# Altium schematic sheet 05-USB-Prog.SchDoc
size B; SheetNumber: 5; SheetTotal: 8
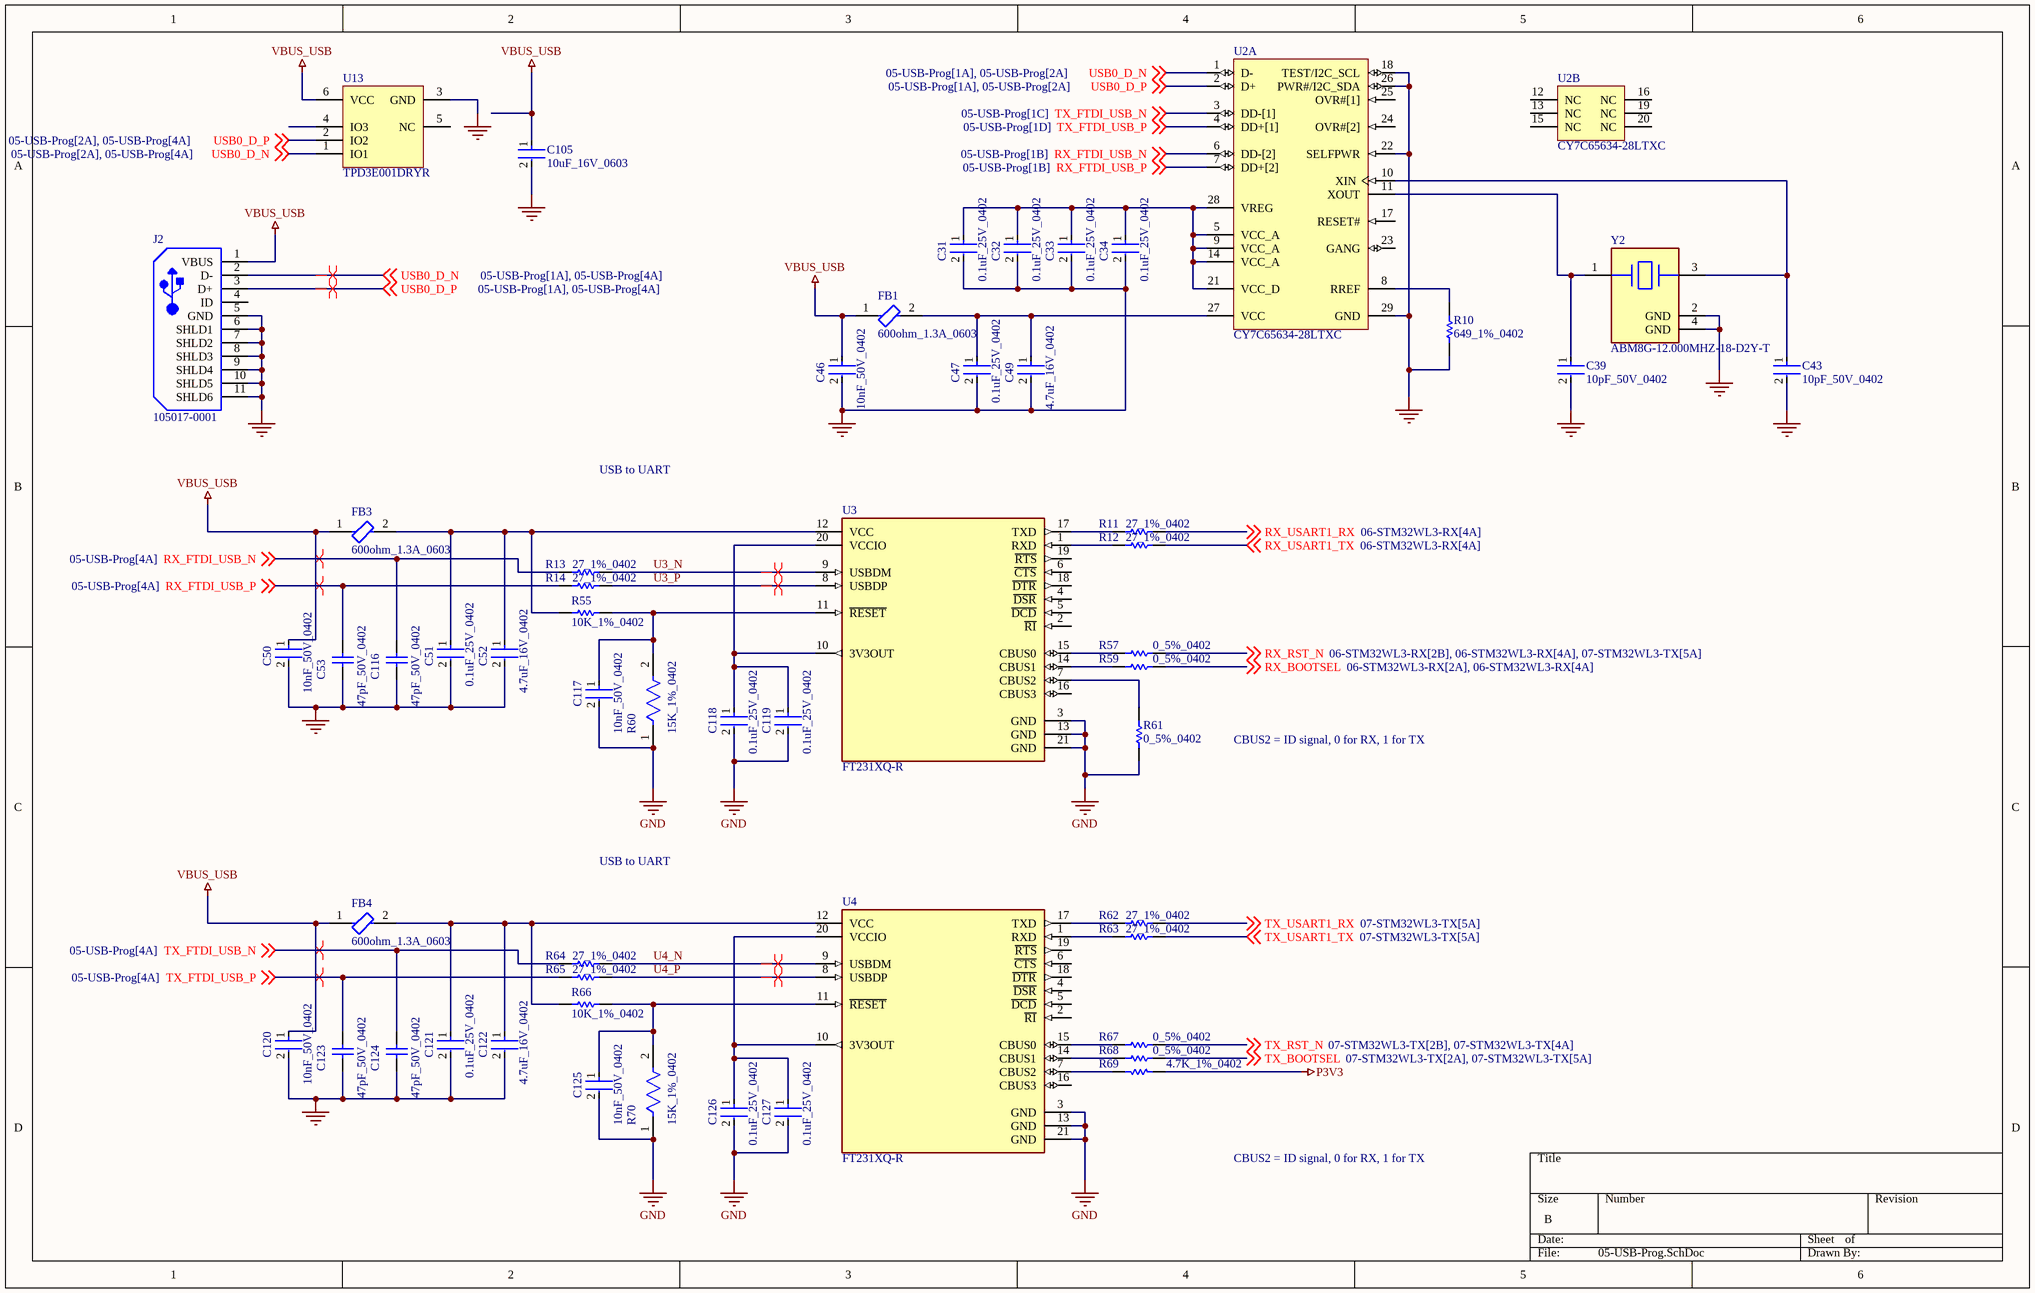
[diagram p0: 05-USB-Prog.SchDoc]

## Parts
C31  0.1uF_25V_0402  [FP-0402-L_1_0_1-W_0_5_0_1-IPC_C]
C32  0.1uF_25V_0402  [FP-0402-L_1_0_1-W_0_5_0_1-IPC_C]
C33  0.1uF_25V_0402  [FP-0402-L_1_0_1-W_0_5_0_1-IPC_C]
C34  0.1uF_25V_0402  [FP-0402-L_1_0_1-W_0_5_0_1-IPC_C]
C39  10pF_50V_0402  [FP-C1005-050-0_05-IPC_C]
C43  10pF_50V_0402  [FP-C1005-050-0_05-IPC_C]
C46  10nF_50V_0402  [FP-CC0402-MFG]
C47  0.1uF_25V_0402  [FP-0402-L_1_0_1-W_0_5_0_1-IPC_C]
C49  4.7uF_16V_0402  [FP-CL829-IPC_C]
C50  10nF_50V_0402  [FP-CC0402-MFG]
C51  0.1uF_25V_0402  [FP-0402-L_1_0_1-W_0_5_0_1-IPC_C]
C52  4.7uF_16V_0402  [FP-CL829-IPC_C]
C53  47pF_50V_0402  [CAPC1005X55X25LL05T10]
C105  10uF_16V_0603  [FP-0603-L_1_6_0_2-W_0_8_0-MFG]
C116  47pF_50V_0402  [CAPC1005X55X25LL05T10]
C117  10nF_50V_0402  [FP-CC0402-MFG]
C118  0.1uF_25V_0402  [FP-0402-L_1_0_1-W_0_5_0_1-IPC_C]
C119  0.1uF_25V_0402  [FP-0402-L_1_0_1-W_0_5_0_1-IPC_C]
C120  10nF_50V_0402  [FP-CC0402-MFG]
C121  0.1uF_25V_0402  [FP-0402-L_1_0_1-W_0_5_0_1-IPC_C]
C122  4.7uF_16V_0402  [FP-CL829-IPC_C]
C123  47pF_50V_0402  [CAPC1005X55X25LL05T10]
C124  47pF_50V_0402  [CAPC1005X55X25LL05T10]
C125  10nF_50V_0402  [FP-CC0402-MFG]
C126  0.1uF_25V_0402  [FP-0402-L_1_0_1-W_0_5_0_1-IPC_C]
C127  0.1uF_25V_0402  [FP-0402-L_1_0_1-W_0_5_0_1-IPC_C]
FB1  600ohm_1.3A_0603  [FP-BLM18-0_15-t0_8-IPC_A]
FB3  600ohm_1.3A_0603  [FP-BLM18-0_15-t0_8-IPC_A]
FB4  600ohm_1.3A_0603  [FP-BLM18-0_15-t0_8-IPC_A]
J2  105017-0001  [USB-MICRO-B_V]
R10  649_1%_0402  [RESC1005X40X25LL05T05]
R11  27_1%_0402  [RESC1005X40X25NL05T05]
R12  27_1%_0402  [RESC1005X40X25NL05T05]
R13  27_1%_0402  [RESC1005X40X25NL05T05]
R14  27_1%_0402  [RESC1005X40X25NL05T05]
R55  10K_1%_0402  [RESC1005X40X25LL05T10]
R57  0_5%_0402  [RESC1005X40X25NL05T10]
R59  0_5%_0402  [RESC1005X40X25NL05T10]
R60  15K_1%_0402  [FP-ERJ2R-MFG]
R61  0_5%_0402  [RESC1005X40X25NL05T10]
R62  27_1%_0402  [RESC1005X40X25NL05T05]
R63  27_1%_0402  [RESC1005X40X25NL05T05]
R64  27_1%_0402  [RESC1005X40X25NL05T05]
R65  27_1%_0402  [RESC1005X40X25NL05T05]
R66  10K_1%_0402  [RESC1005X40X25LL05T10]
R67  0_5%_0402  [RESC1005X40X25NL05T10]
R68  0_5%_0402  [RESC1005X40X25NL05T10]
R69  4.7K_1%_0402  [RESC1005X40X25NL10T10]
R70  15K_1%_0402  [FP-ERJ2R-MFG]
U2  CY7C65634-28LTXC  [CYP-LTX28_M]  (parts A,B of 2)
U3  FT231XQ-R  [FP-QFN-20-MFG]
U4  FT231XQ-R  [FP-QFN-20-MFG]
U13  TPD3E001DRYR  [DRY0006A]
Y2  ABM8G-12.000MHZ-18-D2Y-T  [FP-ABM8G-MFG]

## Nets
GND: C31.2 C32.2 C33.2 C34.2 C39.2 C43.2 C46.2 C47.2 C49.2 C50.2 C51.2 C52.2 C53.1 C105.2 C116.1 C117.2 C118.2 C119.2 C120.2 C121.2 C122.2 C123.1 C124.1 C125.2 C126.2 C127.2 J2.5(GND) J2.6(SHLD1) J2.7(SHLD2) J2.8(SHLD3) J2.9(SHLD4) J2.10(SHLD5) J2.11(SHLD6) R10.1 R60.1 R61.1 R70.1 U2.18(TEST/I2C_SCL) U2.22(SELFPWR) U2.26(PWR#/I2C_SDA) U2.29(GND) U3.3(GND) U3.13(GND) U3.21(GND) U4.3(GND) U4.13(GND) U4.21(GND) U13.3(GND) Y2.2(GND) Y2.4(GND)
P3V3: R69.1
VBUS_USB: C46.1 C50.1 C105.1 C120.1 FB1.1 FB3.1 FB4.1 J2.1(VBUS) U13.6(VCC)
RX_BOOTSEL: R59.2 ; off-sheet RX_BOOTSEL
RX_FTDI_USB_N: C116.2 R13.1 U2.6(DD-[2]) ; off-sheet RX_FTDI_USB_N
RX_FTDI_USB_P: C53.2 R14.1 U2.7(DD+[2]) ; off-sheet RX_FTDI_USB_P
RX_RST_N: R57.2 ; off-sheet RX_RST_N
RX_USART1_RX: R11.2 ; off-sheet RX_USART1_RX
RX_USART1_TX: R12.2 ; off-sheet RX_USART1_TX
TX_BOOTSEL: R68.2 ; off-sheet TX_BOOTSEL
TX_FTDI_USB_N: C124.2 R64.1 U2.3(DD-[1]) ; off-sheet TX_FTDI_USB_N
TX_FTDI_USB_P: C123.2 R65.1 U2.4(DD+[1]) ; off-sheet TX_FTDI_USB_P
TX_RST_N: R67.2 ; off-sheet TX_RST_N
TX_USART1_RX: R62.2 ; off-sheet TX_USART1_RX
TX_USART1_TX: R63.2 ; off-sheet TX_USART1_TX
U3_N: R13.2 U3.9(USBDM)
U3_P: R14.2 U3.8(USBDP)
U4_N: R64.2 U4.9(USBDM)
U4_P: R65.2 U4.8(USBDP)
USB0_D_N: J2.2(D-) U2.1(D-) U13.1(IO1) ; off-sheet USB0_D_N
USB0_D_P: J2.3(D+) U2.2(D+) U13.2(IO2) ; off-sheet USB0_D_P
NetC31_1: C31.1 C32.1 C33.1 C34.1 U2.5(VCC_A) U2.9(VCC_A) U2.14(VCC_A) U2.21(VCC_D) U2.28(VREG)
NetC39_1: C39.1 U2.11(XOUT) Y2.1
NetC43_1: C43.1 U2.10(XIN) Y2.3
NetC47_1: C47.1 C49.1 FB1.2 U2.27(VCC)
NetC51_1: C51.1 C52.1 FB3.2 R55.2 U3.12(VCC)
NetC117_1: C117.1 R55.1 R60.2 U3.11(~{RESET})
NetC118_1: C118.1 C119.1 U3.10(3V3OUT) U3.20(VCCIO)
NetC121_1: C121.1 C122.1 FB4.2 R66.2 U4.12(VCC)
NetC125_1: C125.1 R66.1 R70.2 U4.11(~{RESET})
NetC126_1: C126.1 C127.1 U4.10(3V3OUT) U4.20(VCCIO)
NetR10_2: R10.2 U2.8(RREF)
NetR11_1: R11.1 U3.17(TXD)
NetR12_1: R12.1 U3.1(RXD)
NetR57_1: R57.1 U3.15(CBUS0)
NetR59_1: R59.1 U3.14(CBUS1)
NetR61_2: R61.2 U3.7(CBUS2)
NetR62_1: R62.1 U4.17(TXD)
NetR63_1: R63.1 U4.1(RXD)
NetR67_1: R67.1 U4.15(CBUS0)
NetR68_1: R68.1 U4.14(CBUS1)
NetR69_2: R69.2 U4.7(CBUS2)

Not connected (* = marked no-connect by the designer): J2 4(ID); U2 12(NC) 13(NC) 15(NC) 16(NC) 17(RESET#) 19(NC) 20(NC) 23(GANG) 24(OVR#[2]) 25(OVR#[1]); U3 2(~{RI}) 4(~{DSR}) 5(~{DCD}) 6(~{CTS}) 16(CBUS3) 18(~{DTR}) 19(~{RTS}); U4 2(~{RI}) 4(~{DSR}) 5(~{DCD}) 6(~{CTS}) 16(CBUS3) 18(~{DTR}) 19(~{RTS}); U13 4(IO3) 5(NC)

## Layout directives
differential pair: RX_FTDI_USB_N, RX_FTDI_USB_P, TX_FTDI_USB_N, TX_FTDI_USB_P, U3_N, U3_P, U4_N, U4_P, USB0_D_N, USB0_D_P

## Notes on the sheet
- USB to UART
- CBUS2 = ID signal, 0 for RX, 1 for TX

## Library data of the parts
C31-C34 C47 C51 C118 C119 C121 C126 C127 = CMP-2008-02519-2: General Purpose Ceramic Capacitor, 0402, 100nF, 10%, X7R, 15%, 25V; Package Quantity: 1; Capacitance: 100nF; Min Operating Temperature: -55°C; Voltage: 25V; Voltage Rating: 25V; Construction: Flat; Max Operating Temperature: 125°C; Radiation Hardening: No; Depth: 0.5mm; Thickness: 0.022inch; Voltage Rating (DC): 25V; Number of Pins: 2; Lead Free: Lead Free; Series: -; REACH SVHC: No SVHC; Length: 1mm; Dielectric: X7R; RoHS Compliant: Yes; Mount: Surface Mount; Packaging: Tape and Reel; Case/Package: 0402; Case Code (Imperial): 0402; Termination: SMD/SMT; Width: 0.02inch; Case Code (Metric): 1005; Tolerance: 10%
C39 C43 = CMP-08246-002674-1: CAP CER 10PF 50V C0G 0402; Temperature Coefficient: 30ppm/°C; Dielectric Material: Ceramic; Termination: SMD/SMT; Width: 0.02inch; Case Code (Metric): 1005; Thickness: 0.022inch; Height: 0.5mm; REACH SVHC: No SVHC; Case Code (Imperial): 0402; Voltage: 50V; Capacitance: 10pF; Max Operating Temperature: 125°C; Length: 1mm; Construction: Flat; Packaging: Tape and Reel; Lead Free: Lead Free; Series: C; Depth: 0.5mm; Dielectric: C0G; Package Quantity: 1; Mount: Surface Mount; Voltage Rating (DC): 50V; Voltage Rating: 50V; Case/Package: 0402; RoHS Compliant: Yes; Min Operating Temperature: -55°C; Number of Pins: 2; Radiation Hardening: No; Weight: 2.3E-05oz
C46 C50 C117 C120 C125 = CMP-2100-03592-2: CAP CER 10000PF 50V X7R 0402; Manufacturer Part Number: CC0402KRX7R9BB103; Manufacturer: YAGEO; Temperature Coefficient: 30ppm/°C; Capacitance: 10 nF; Material: Ceramic; Automotive Grade: NA; Tolerance: 0.1; Value: 10 nF; Device Class L3: Ceramic Capacitors; Temperature: -55°C to +125°C; Footprint Url: http://www.yageo.com/exep/pages/download/literatures/UPY-C_GEN_24.pdf; Ipc Land Pattern Name: CAPC10050X50; Device Class L1: Passive Components; Automotive: No; Octopart: https://octopart.com/cc0402krx7r9bb103-yageo-8376513; Lead Free: Yes; Temperature Range Low: -55°C; Height: 0.55mm; ComponentLink2URL: http://www.yageo.com/documents/recent/UPY-GP_NP0_16V-to-50V_16.pdf; Category: Cap; ComponentLink2Description: Datasheet; Temperature Range High: +125°C; Digikey Description: CAP CER 10000PF 50V X7R 0402; Voltage Rating: 50 V; Package: CC0402; Device Class L2: Capacitors; Mouser Description: 0402 10 nF 50 V ±10 % Tolerance X7R SMT Multilayer Ceramic Capacitor; RoHS: TRUE; Temperature Characteristic: X7R
C49 C52 C122 = CMP-13271-001468-1: Cap Ceramic 4.7uF 16V X5R ±20% SMD 0402 +85°C Paper T/R; Mount: Surface Mount; Case Code (Metric): 1005; Case/Package: 0402; Length: 0.039inch; Capacitance: 4.7uF; Voltage Rating: 16V; Max Operating Temperature: 85°C; Tolerance: 20%; Thickness: 0.022inch; Min Operating Temperature: -55°C; Case Code (Imperial): 0402; Packaging: Tape and Reel; Width: 0.02inch
C53 C116 C123 C124 = CMP-2008-04368-1: Part Number: GRM1555C1H470JA01D; Manufacturer: Murata
C105 = CMP-2000-06226-4: Multilayer Ceramic Capacitor 10uF 16V X5R 20% SMD 0603 T/R; Packaging: Tape and Reel; Construction: Flat; Height: 0.8mm; Max Operating Temperature: 85°C; Dielectric: X5R; Case Code (Metric): 1608; Voltage Rating (DC): 16V; Width: 0.031inch; Voltage Rating: 16V; Length: 0.063inch; RoHS Compliant: Yes; Halogen Free: Halogen Free; Case Code (Imperial): 0603; Capacitance: 10uF; Mount: Surface Mount; Thickness: 0.031inch; Tolerance: 20%; Min Operating Temperature: -55°C; Series: M; Termination: SMD/SMT; Case/Package: 0603; Package Quantity: 1
FB1 FB3 FB4 = CMP-0686-00581-3: Chip Ferrite Bead, 0603, 600Ω @ 100MHz, 0.15Ω, 25%, 1.3A; Material: Steel; Number of Lines: 1; Impedance: 600R; DC Resistance (DCR): 150mR; Tolerance: 25%; Case Code (Metric): 1608; Width: 0.8mm; DC Current: 1.3A; Max DC Current: 1.3A; Package Quantity: 1; Number of Pins: 2; Military Standard: Not; RoHS Compliant: Yes; Termination: SMD/SMT; Max Operating Temperature: 125°C; Length: 1.6mm; Depth: 0.8mm; Case Code (Imperial): 0603; Series: BLM18K; Inductor Type: FERRITE BEAD; Core Material: Ferrite; Number of Circuits: 1; Height: 0.8mm; Case/Package: 0603; REACH SVHC: No SVHC; Packaging: Tape and Reel; Min Operating Temperature: -55°C; Max Current Rating: 1.3A; Radiation Hardening: No; Current Rating: 1.3A; Lead Free: Lead Free; Test Frequency: 100MHz; Weight: 7.1E-05oz
J2 = CMP-2000-05827-1: Micro-USB B Receptacle, Right Angle, Bottom Mount, Surface Mount, with Solder Tabs, -30 to 85 degC, 5-Pin USB, RoHS, Tape and Reel; Manufacturer: Molex; Featured Product: Micro-USBConnectorsUSBConnectors; Other Names: WM1399DKR; Package Version: Rev. F, 12/2012; Number of Contacts: 5; Connector Type: USB-microB; Catalog Drawings: 1050170001; 3D Model: 105017-0001.stp; Mating Products: WM17145-ND-CABLEMICROUSBBTOSTDA1.0MWM17147-ND-CABLEMICROUSBBTOSTDA2.0MWM17146-ND-CABLEMICROUSBBTOSTDA1.5M; PCN Assembly/Origin: ResinSupplier21/Oct/2015; Voltage - Max: 30V; Online Catalog: Molex-MicroUSB; Manufacturer URL: http://www.molex.com/; Package Description: 5-Leads USB, Micro B, Body 7.5 x 5 mm, Pitch 0.65 mm; Datasheet URL: http://www.molex.com/elqNow/elqRedir.htm?ref=http://www.molex.com/webdocs/datasheets/pdf/en-us/1050170001_IO_CONNECTORS.pdf; Ingress Protection: -; Datasheet Version: 03/2016; Mounting Type: BoardCutout,SurfaceMount,RightAngle; Circuits: 5; Standard Package: 1; Package Reference: MICRO-B; Package URL: http://www.molex.com/pdm_docs/sd/1050170001_sd.pdf; Category: Connectors,Interconnects; Series: -; RoHS Information: 1050170001CertofCompliance; Features: Shielded,SolderRetention; Family: USB,DVI,HDMIConnectors; Specifications: -; Gender: Receptacle; Packaging: Digi-Reel®; Mounting Technology: SurfaceMount
R10 = CMP-2002-01027-1: Part Number: ERJ-2RKF6490X; Manufacturer: Panasonic
R11-R14 R62-R65 = CMP-2002-08434-1: Part Number: CRCW040227R0FKED; Manufacturer: Vishay Dale
R55 R66 = CMP-2002-07353-1: Part Number: RC0402FR-0710KL; Manufacturer: Yageo / Phycomp
R57 R59 R61 R67 R68 = CMP-2002-06457-1: Manufacturer: Panasonic; Part Number: ERJ-U020R00X
R60 R70 = CMP-2002-00694-4: RES SMD 15K OHM 1% 1/10W 0402; Manufacturer Part Number: ERJ-2RKF1502X; Manufacturer: Panasonic; Automotive Grade: Grade 0; Voltage Rating: 50V; Resistance: 15kΩ; Temperature Coefficient: 100ppm/°C; Power Rating: 0.1W; Value: 15kΩ; ComponentLink2URL: https://industrial.panasonic.com/cdbs/www-data/pdf/RDA0000/AOA0000C304.pdf; Automotive: Yes; Temperature: -55°C to +155°C; Height: 0.4mm; Digikey Description: RES SMD 15K OHM 1% 1/10W 0402; Category: Res; Device Class L2: Resistors; Device Class L1: Passive Components; Package: ERJ2R; Temperature Range Low: -55°C; Tolerance: 1%; Series: ERJ; Footprint Url: https://b2b-api.panasonic.eu/file_stream/pids/fileversion/1180; Mouser Description: Res Thick Film 1.0 x 0.5 mm 15K Ohm 1% 0.1W(1/10W) 100ppm/ C Molded SMD Punched Carrier T/R; Composition: Thick Film; Lead Free: Yes; Device Class L3: Chip SMD Resistors; Octopart: https://octopart.com/erj-2rkf1502x-panasonic-55404985; RoHS: TRUE; Temperature Range High: +155°C; ComponentLink2Description: Datasheet
R69 = CMP-2002-05217-1: Manufacturer: Bourns; Part Number: CR0402-FX-4701GLF
U2 = CMP-0967-00085-1: HX2VL(TM) Very Low Power USB 2.0 Hub Controller, 2 Hub Ports, 0 to 70 degC, 28-Pin QFN (LTX28), Bulk; Manufacturer: Cypress; No. of Hub Ports: 2; Max. Operating Voltage (V): 5.25; Single/Multi TT: Single; Min. Operating Voltage (V): 3.15; PackageVersion: Rev. **, 10/2010; ComponentLink1Description: Manufacturer URL; Max. Operating Temp. (degreesC): 70; ComponentLink2URL: http://www.cypress.com/?docID=39996; Mounting Technology: Surface Mount; ComponentLink3Description: Package Specification; PackageDescription: 28-Pin Quad Flat No-Lead Package, Body 5 x 5 mm, Pitch 0.5 mm; DatasheetVersion: Rev. *F; RoHS: Pb-Free; Min. Operating Temp. (degreesC): 0; ComponentLink2Description: Datasheet; PackageReference: LTX28; ComponentLink1URL: http://www.cypress.com/; PartNumber: CY7C65634-28LTXC; Packing: Bulk; ComponentLink3URL: http://www.cypress.com/?docID=33735; Code_JEDEC: MO-220
U3 U4 = CMP-0248-00001-3: IC USB SERIAL FULL UART 20QFN; Data Rate: 12Mbps; Operating Supply Current: 8mA; Min Supply Voltage: 2.97V; Max Supply Voltage: 5.5V; Number of Channels: 1; Min Operating Temperature: -40°C; Case/Package: QFN; Mount: Surface Mount; Number of Pins: 20; Interface: UART; Lead Free: Lead Free; Package Quantity: 5000; Weight: 0.004339oz; Packaging: Tape and Reel; Max Operating Temperature: 85°C
U13 = CMP-0326-00032-3: Low-Capacitance + / - 15 kV ESD-Protection Array for High-Speed Data Interfaces, 3 Channels, -40 to +85 degC, 6-pin SON (DRY), Green (RoHS & no Sb/Br); Manufacturer: Texas Instruments; USB High Speed: TRUE; SubFamily: ESD Solution; IO Capacitance(Typ)(pF): 1.5; IEC 61000-4-2 Contact(+/- kV): 8; IO Leakage Current(nA): Jan-00; Breakdown Voltage(Min)(V): 11; IEC 61000-4-2 Air-Gap(+/- kV): 15; DatasheetVersion: SLLS683D; Mounting Technology: Surface Mount; ComponentLink1URL: http://www.ti.com/; PackageReference: DRY0006A; ComponentLink2URL: http://www.ti.com/general/docs/lit/getliterature.tsp?genericPartNumber=TPD3E001&fileType=pdf; ComponentLink2Description: Datasheet; ComponentLink3Description: URL Link1; PackageDescription: 6-Pin Plastic Small Outline No-Lead, 1 x 1.45 x 0.6 mm Body, 0.5 mm Pitch; ComponentLink1Description: Manufacturer URL; PackageVersion: revF, Dec-2011; PartNumber: TPD3E001DRYR; Eco-Plan: Green (RoHS & no Sb/Br); ComponentLink3URL: SamplesURL:http://www.ti.com/product/tpd3e001#samples
Y2 = CMP-2000-05039-3: Crystal 12MHz ±20ppm (Tol) ±30ppm (Stability) 18pF FUND 120Ω 4-Pin SMD T/R; Series Resistance: 120R; Max Operating Temperature: 85°C; Mount: Surface Mount; Width: 2.5mm; Series: ABM8G; Termination: SMD/SMT; Frequency Tolerance: 20ppm; Tolerance: 20ppm; Min Operating Temperature: -40°C; Operating Frequency: 12 MHz; Depth: 2.5mm; Load Capacitance: 18pF; Number of Pins: 4; Length: 3.2mm; Radiation Hardening: No; Frequency Stability: 30ppm; Height: 1mm; Packaging: Tape and Reel; Package Quantity: 1000; ESR (Equivalent Series Resistance): 120R; Lead Free: Lead Free; Frequency: 12MHz; Case/Package: CSMD